# EasyEDA schematic SCHEMATIC.json
TITLE: Sheet_1; REV: 1.0; Date: 2026-07-16; Sheet: 1/1; Drawn By: sarhamishra; Company: Your Company
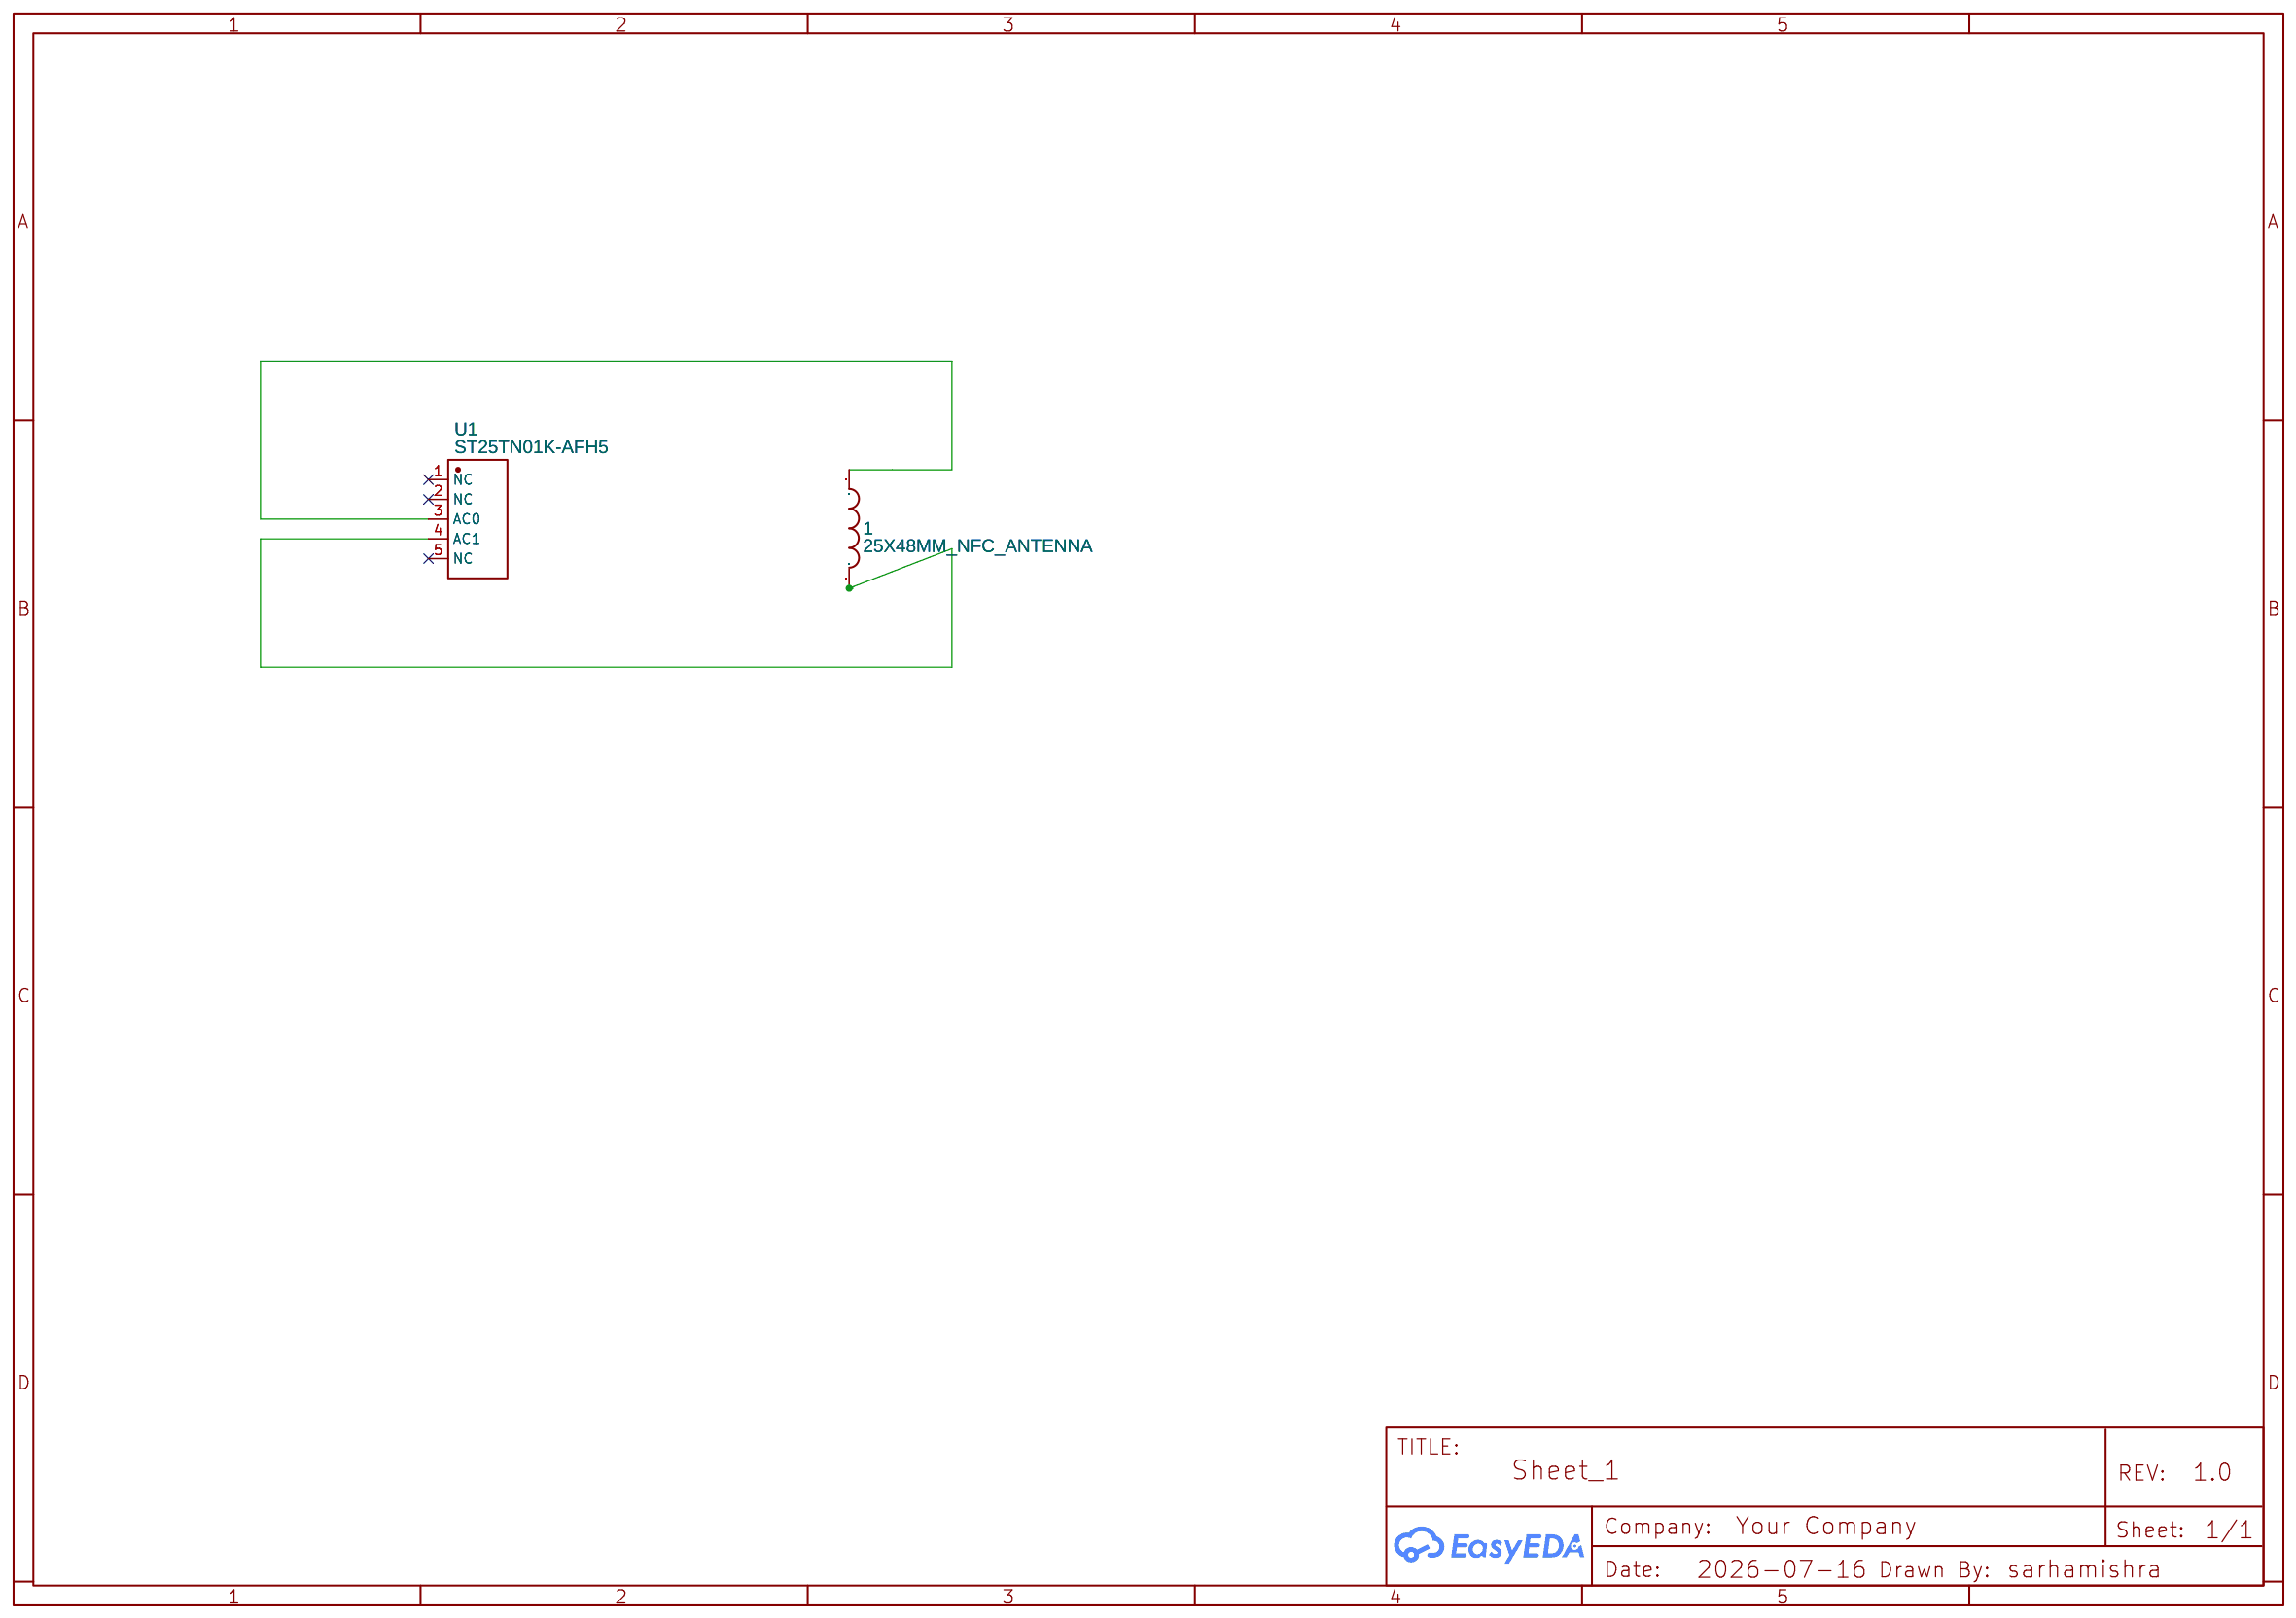
[diagram p0: schematic sheet]

## Parts
1  25X48MM_NFC_ANTENNA  [25X48MM_NFC_ANTENNA]
U1  ST25TN01K-AFH5  [UFDFPN-5_L1.7-W1.4-P0.40-BL]

## Library data of the parts
1 = 25X48MM_NFC_ANTENNA: Contributor: hugo1
U1 = ST25TN01K-AFH5: Contributor: lcsc; Supplier: LCSC; Supplier Part: C3303589; Manufacturer: ST(意法半导体); JLCPCB Part Class: Extended Part

## Nets
Net-(1-P$1): 1.P$1 U1.3(AC0)
Net-(1-P$2): 1.P$2 U1.4(AC1)

Not connected (* = marked no-connect by the designer): U1 1(NC)* 2(NC)* 5(NC)*
